# EAGLE schematic PCB-3SLIDER45 (EAGLE 6.4)

## Sheet 1 of 2
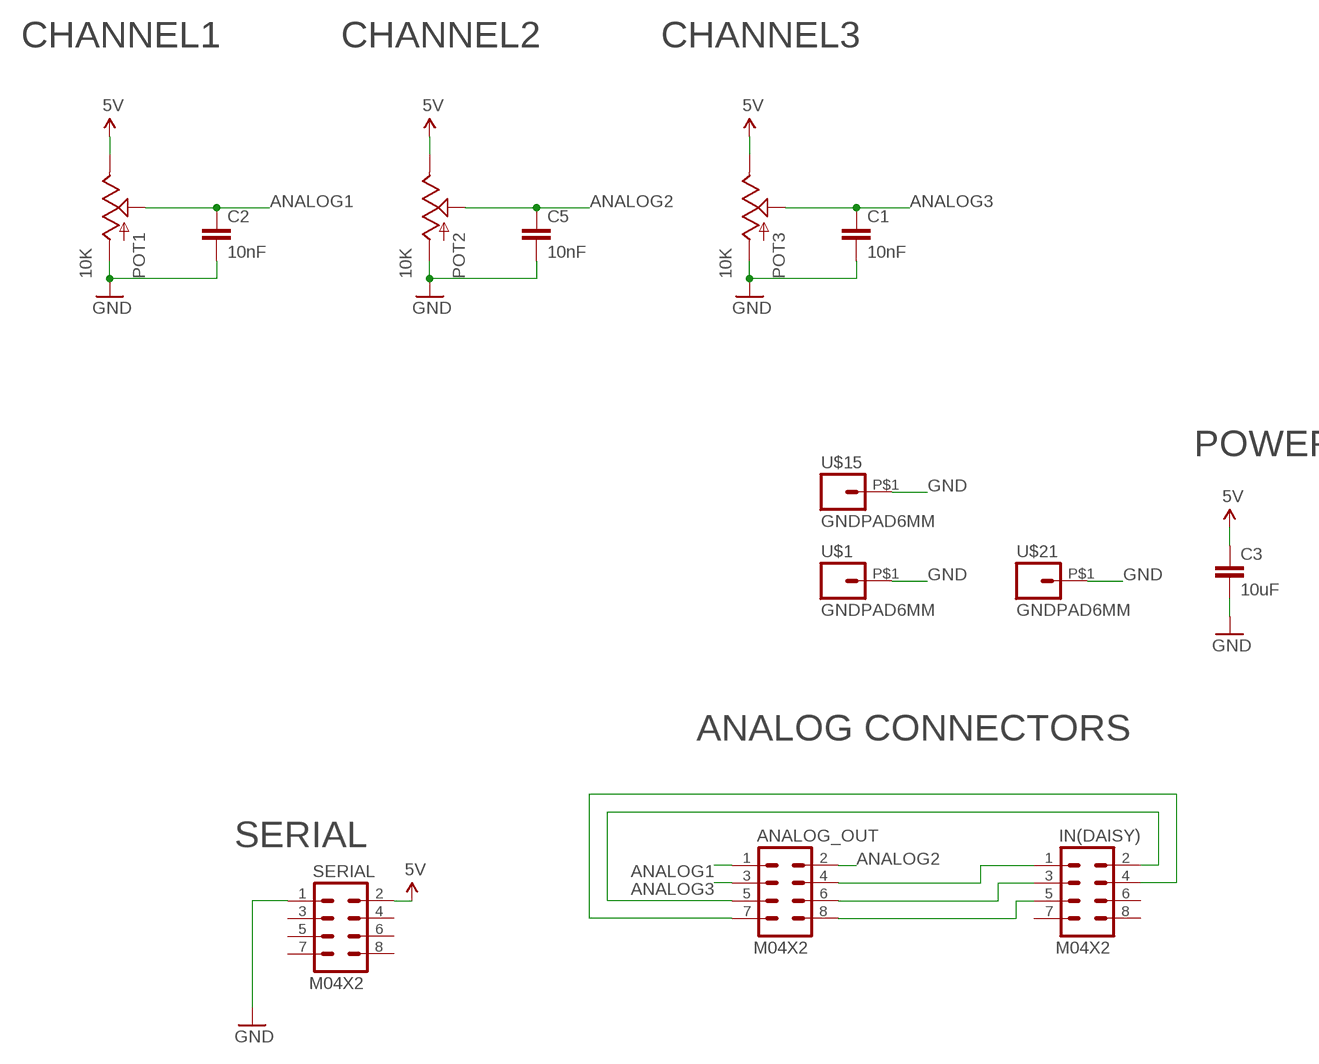
[diagram p0: schematic, sheet 1]

### Parts
ANALOG_OUT  M04X2  [2X4]
C1  10nF  CAP0603-CAP  [0603-CAP]
C2  10nF  CAP0603-CAP  [0603-CAP]
C3  10uF  CAP0805  [0805]
C5  10nF  CAP0603-CAP  [0603-CAP]
IN(DAISY)  M04X2  [2X4]
POT1  10K  SLIDER45  [SLIDER45]
POT2  10K  SLIDER45  [SLIDER45]
POT3  10K  SLIDER45  [SLIDER45]
SERIAL  M04X2  [2X4]
U$1  GNDPAD6MM  [3.2MMPAD6MM]
U$15  GNDPAD6MM  [3.2MMPAD6MM]
U$21  GNDPAD6MM  [3.2MMPAD6MM]

### Nets
5V [Power]: C3.1 POT1.1(E) POT2.1(E) POT3.1(E) SERIAL.2
ANALOG1: ANALOG_OUT.1 C2.1 POT1.2A(S)
ANALOG2: ANALOG_OUT.2 C5.1 POT2.2A(S)
ANALOG3: ANALOG_OUT.3 C1.1 POT3.2A(S)
GND [Power]: C1.2 C2.2 C3.2 C5.2 POT1.3(A) POT2.3(A) POT3.3(A) SERIAL.1 U$1.P$1 U$15.P$1 U$21.P$1
N$1: ANALOG_OUT.4 IN(DAISY).1
N$2: ANALOG_OUT.5 IN(DAISY).2
N$3: ANALOG_OUT.6 IN(DAISY).3
N$4: ANALOG_OUT.7 IN(DAISY).4
N$5: ANALOG_OUT.8 IN(DAISY).5
Unconnected: IN(DAISY).6 IN(DAISY).7 IN(DAISY).8 SERIAL.3 SERIAL.4 SERIAL.5 SERIAL.6 SERIAL.7 SERIAL.8

### Notes on the sheet
- CHANNEL1 | CHANNEL2 | CHANNEL3
- POWER
- ANALOG CONNECTORS
- SERIAL

## Sheet 2 of 2

## Library data of the parts
ANALOG_OUT IN(DAISY) SERIAL = SparkFun:M04X2
C1-C3 C5 = SparkFun:CAP: Capacitor Standard 0603 ceramic capacitor, and 0.1" leaded capacitor.
POT1-POT3 = SKAARHOJ:SLIDER
U$1 U$15 U$21 = SKAARHOJ:GNDPAD

## Net classes
0 default: width 0.203 mm, drill 0.406 mm, clearance 0.203 mm
1 Power: width 0.406 mm, drill 0.61 mm, clearance 0.203 mm